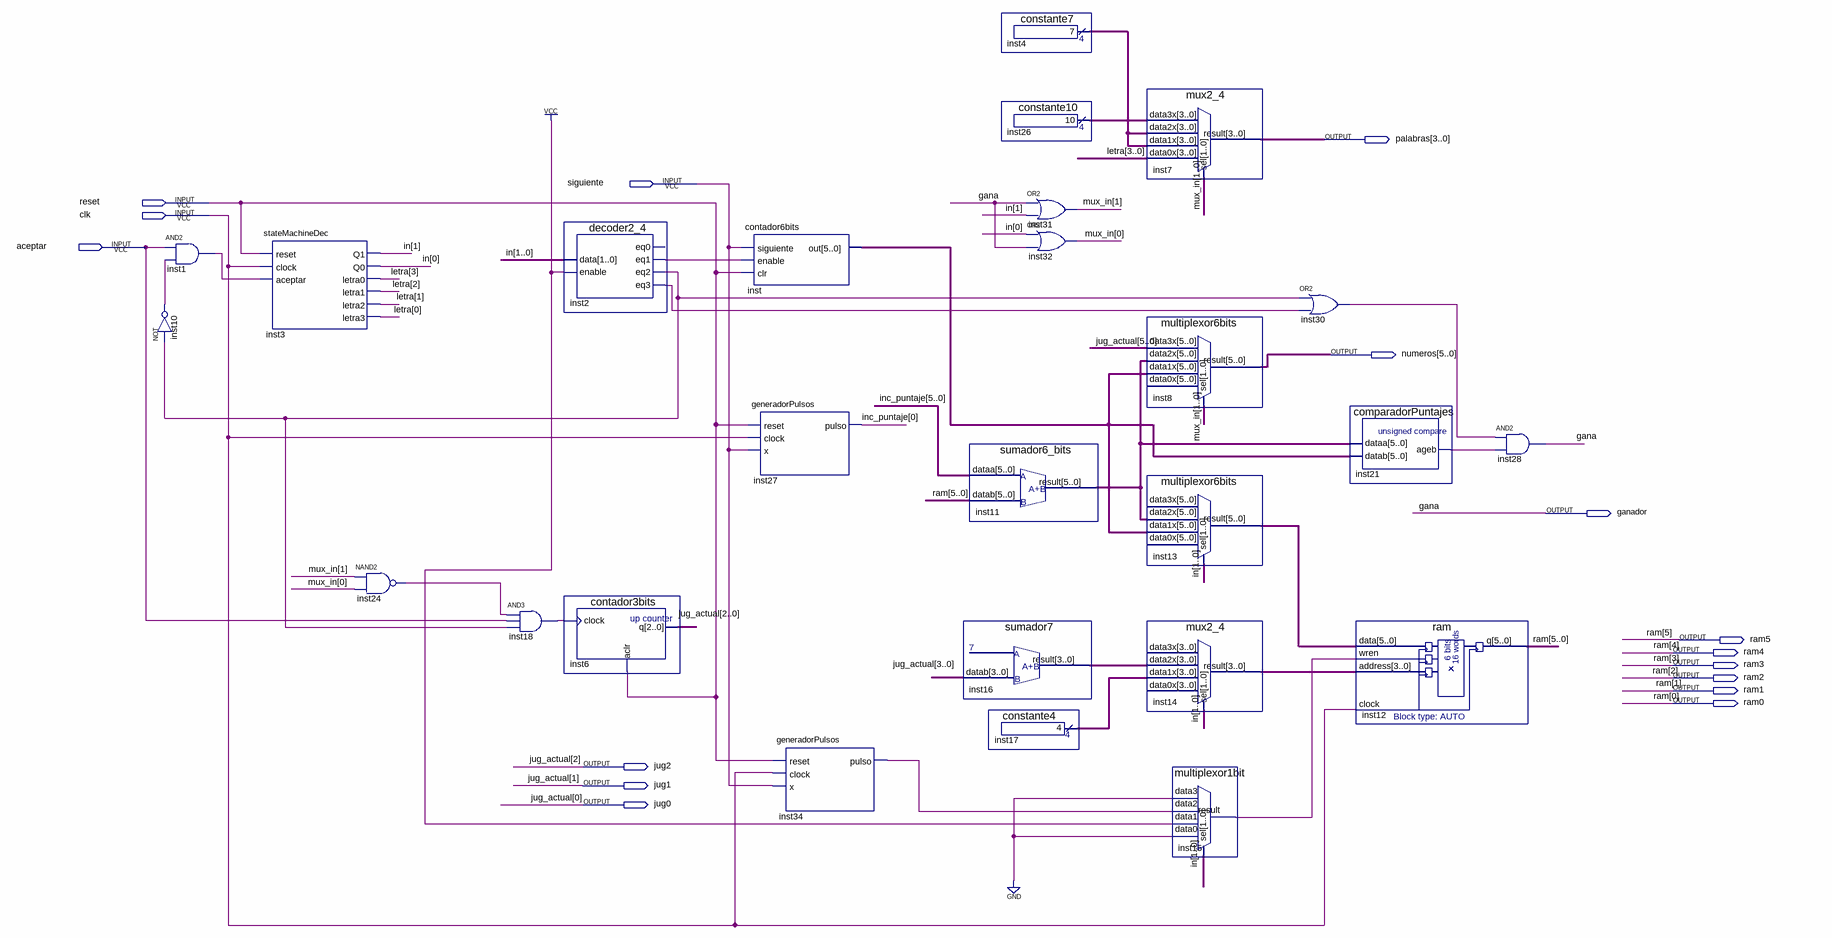
[diagram p0: schematic sheet]
// Quartus schematic decoderJuego.bdf as structural Verilog: 26 symbols, 16 pins
module decoderJuego (
  input  siguiente,
  input  reset,
  input  clk,
  input  aceptar,
  output [3:0] palabras,
  output [5:0] numeros,
  output ganador,
  output ram5,
  output ram4,
  output ram3,
  output ram2,
  output ram1,
  output ram0,
  output jug2,
  output jug1,
  output jug0
);

  wire inst1_out, inst2_eq1, inst2_eq2, inst2_eq3, inst10_out, inst15_result, inst18_out, inst21_ageb,
       inst24_out, inst30_out, inst34_pulso;
  wire [1:0] in, mux_in;
  wire [3:0] inst4_result, inst14_result, inst16_result, inst17_result, inst26_result, letra;
  wire [5:0] inc_puntaje, inst11_result, inst13_result, inst_out;
  wire [5:3] jug_actual;

  not inst10 (inst10_out, inst2_eq2);
  and inst1 (inst1_out, aceptar, inst10_out);
  stateMachineDec inst3 (
    .reset(reset), .clock(clk), .aceptar(inst1_out), .Q1(in[1]), .Q0(in[0]), .letra0(letra[3]),
    .letra1(letra[2]), .letra2(letra[1]), .letra3(letra[0]));
  nand inst24 (inst24_out, mux_in[1], mux_in[0]);
  and inst18 (inst18_out, inst24_out, aceptar, inst2_eq2);
  decoder2_4 inst2 (.data(in), .enable(1'b1), .eq1(inst2_eq1), .eq2(inst2_eq2), .eq3(inst2_eq3));  // open: eq0
  contador3bits inst6 (.clock(inst18_out), .aclr(reset), .q({jug2, jug1, jug0}));
  contador6bits inst (.siguiente(siguiente), .enable(inst2_eq1), .clr(reset), .out(inst_out));
  generadorPulsos inst27 (.reset(reset), .clock(clk), .x(siguiente), .pulso(inc_puntaje[0]));
  generadorPulsos inst34 (.reset(reset), .clock(clk), .x(siguiente), .pulso(inst34_pulso));
  sumador7 inst16 (.datab({jug_actual[3], jug2, jug1, jug0}), .result(inst16_result));
  constante7 inst4 (.result(inst4_result));
  constante10 inst26 (.result(inst26_result));
  sumador6_bits inst11 (.dataa(inc_puntaje), .datab({ram5, ram4, ram3, ram2, ram1, ram0}), .result(inst11_result));
  constante4 inst17 (.result(inst17_result));
  or inst31 (mux_in[1], ganador, in[1]);
  or inst32 (mux_in[0], in[0], ganador);
  mux2_4 inst7 (
    .data3x(inst26_result), .data2x(inst4_result), .data1x(inst4_result), .data0x(letra), .sel(mux_in),
    .result(palabras));
  multiplexor6bits inst8 (
    .data3x({jug_actual, jug2, jug1, jug0}), .data2x(inst11_result), .data1x(inst_out), .sel(mux_in),
    .result(numeros));  // open: data0x
  multiplexor6bits inst13 (
    .data2x(inst11_result), .data1x(inst_out), .sel(in), .result(inst13_result));  // open: data3x, data0x
  mux2_4 inst14 (
    .data2x(inst16_result), .data1x(inst17_result), .sel(in), .result(inst14_result));  // open: data3x, data0x
  multiplexor1bit inst15 (
    .data3(1'b0), .data2(inst34_pulso), .data1(1'b1), .data0(1'b0), .sel(in), .result(inst15_result));
  or inst30 (inst30_out, inst2_eq2, inst2_eq3);
  comparadorPuntajes inst21 (.dataa(inst11_result), .datab(inst_out), .ageb(inst21_ageb));
  ram inst12 (
    .data(inst13_result), .wren(inst15_result), .address(inst14_result), .clock(clk),
    .q({ram5, ram4, ram3, ram2, ram1, ram0}));
  and inst28 (ganador, inst30_out, inst21_ageb);

  // Other names for the same wires on the sheet: gana = ganador; jug_actual[2:0] = {jug2, jug1, jug0}
endmodule
